# EAGLE design gpio4-st (EAGLE 7.2.0)
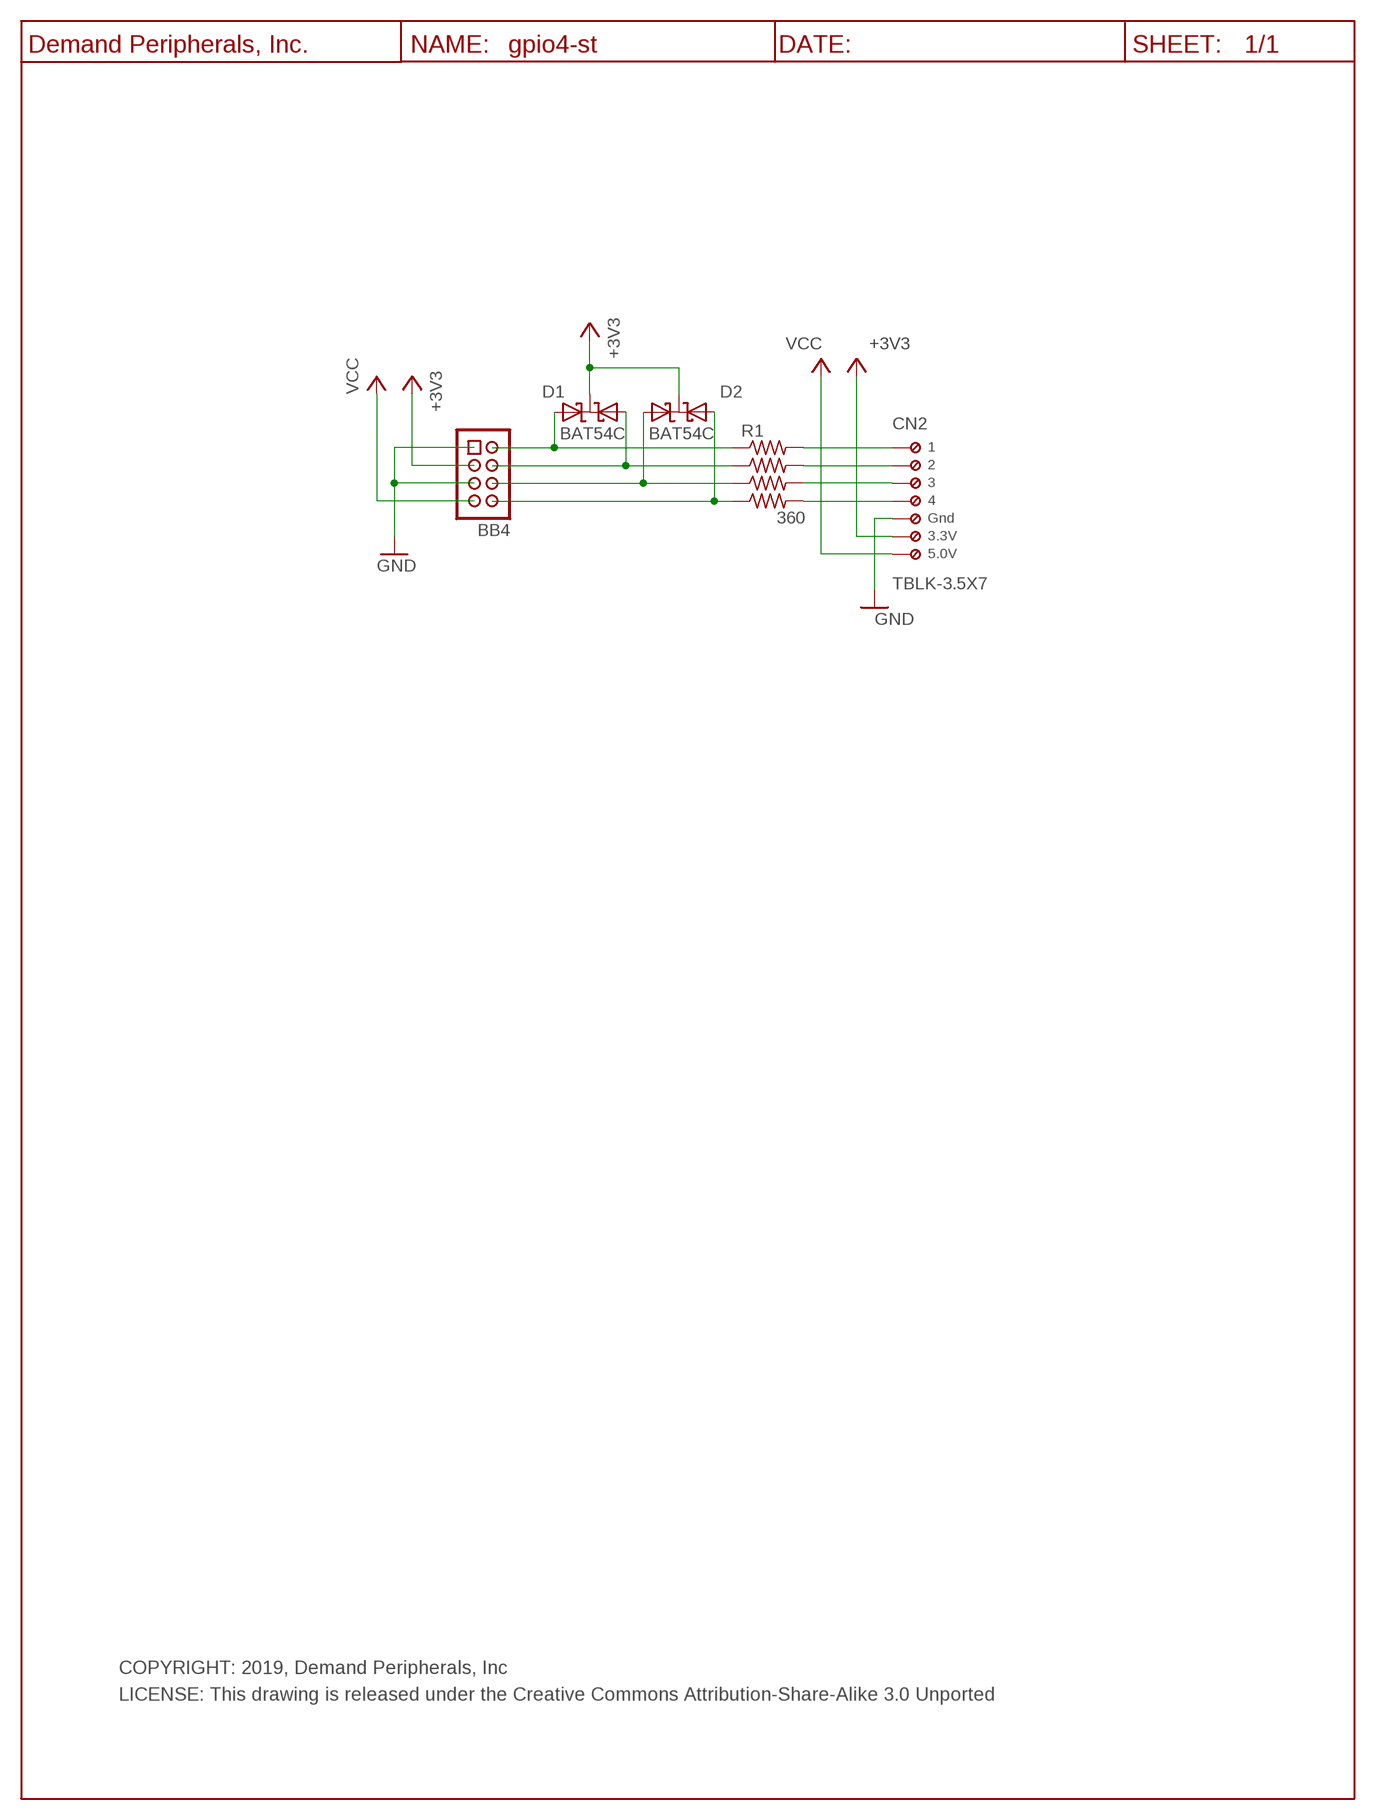
[diagram p0: schematic, sheet 1]

## Parts
BB4  BB_CON  HDR-4X2-SHR  [HDR-4X2]
CN2  TBLK-3.5X7  [TBLK-3.5X7]
D1  BAT54C  [SOT23]
D2  BAT54C  [SOT23]
R1  360  R360_R0603  [R0603]
R2  360  R360_R0603  [R0603]
R3  360  R360_R0603  [R0603]
R4  360  R360_R0603  [R0603]
U$1  DP_FRAME_P  [P_FRAME]

## Nets
+3V3: BB4.3 CN2.6(KL5) D1.3(CC) D2.3(CC)
GND: BB4.1 BB4.5 CN2.5(KL4)
N$1: CN2.1(KL) R1.2
N$2: CN2.2(KL1) R2.2
N$3: CN2.3(KL2) R3.2
N$4: CN2.4(KL3) R4.2
N$11: BB4.2 D1.1(A1) R1.1
N$12: BB4.4 D1.2(A) R2.1
N$14: BB4.6 D2.1(A1) R3.1
N$15: BB4.8 D2.2(A) R4.1
VCC: BB4.7 CN2.7(KL6)

## Notes on the sheet
- 1
- 2
- 3
- 4
- Gnd
- 3.3V
- 5.0V
- COPYRIGHT: 2019, Demand Peripherals, Inc
- LICENSE: This drawing is released under the Creative Commons Attribution-Share-Alike 3.0 Unported

## Library data of the parts
BB4 = dpi-conn:HDR-4X2-SHR: Shrouded 4x2 pin header; VENDOR: Digikey; VENDOR-PART-NUM: 609-3530-ND
CN2 = dpi-conn:TBLK-3.5X7: Screw terminal, 3.5mm, 7 position; VENDOR: Digikey; VENDOR-PART-NUM: ED2745-ND
D1 D2 = dpi-diopto:BAT54C: BAT54C Dual Common Cathode Schottky; VENDOR: Digikey; VENDOR-PART-NUM: DB3X313N0LCT-ND
R1-R4 = dpi-passive:R360_: 360 Ohm resistor, 1%, 0.1 watt; VENDOR: Digikey; VENDOR-PART-NUM: 311-360HRTR-ND
U$1 = dpi-sym:DP_FRAME_P: Portrait/Letter Document Frame

## Board
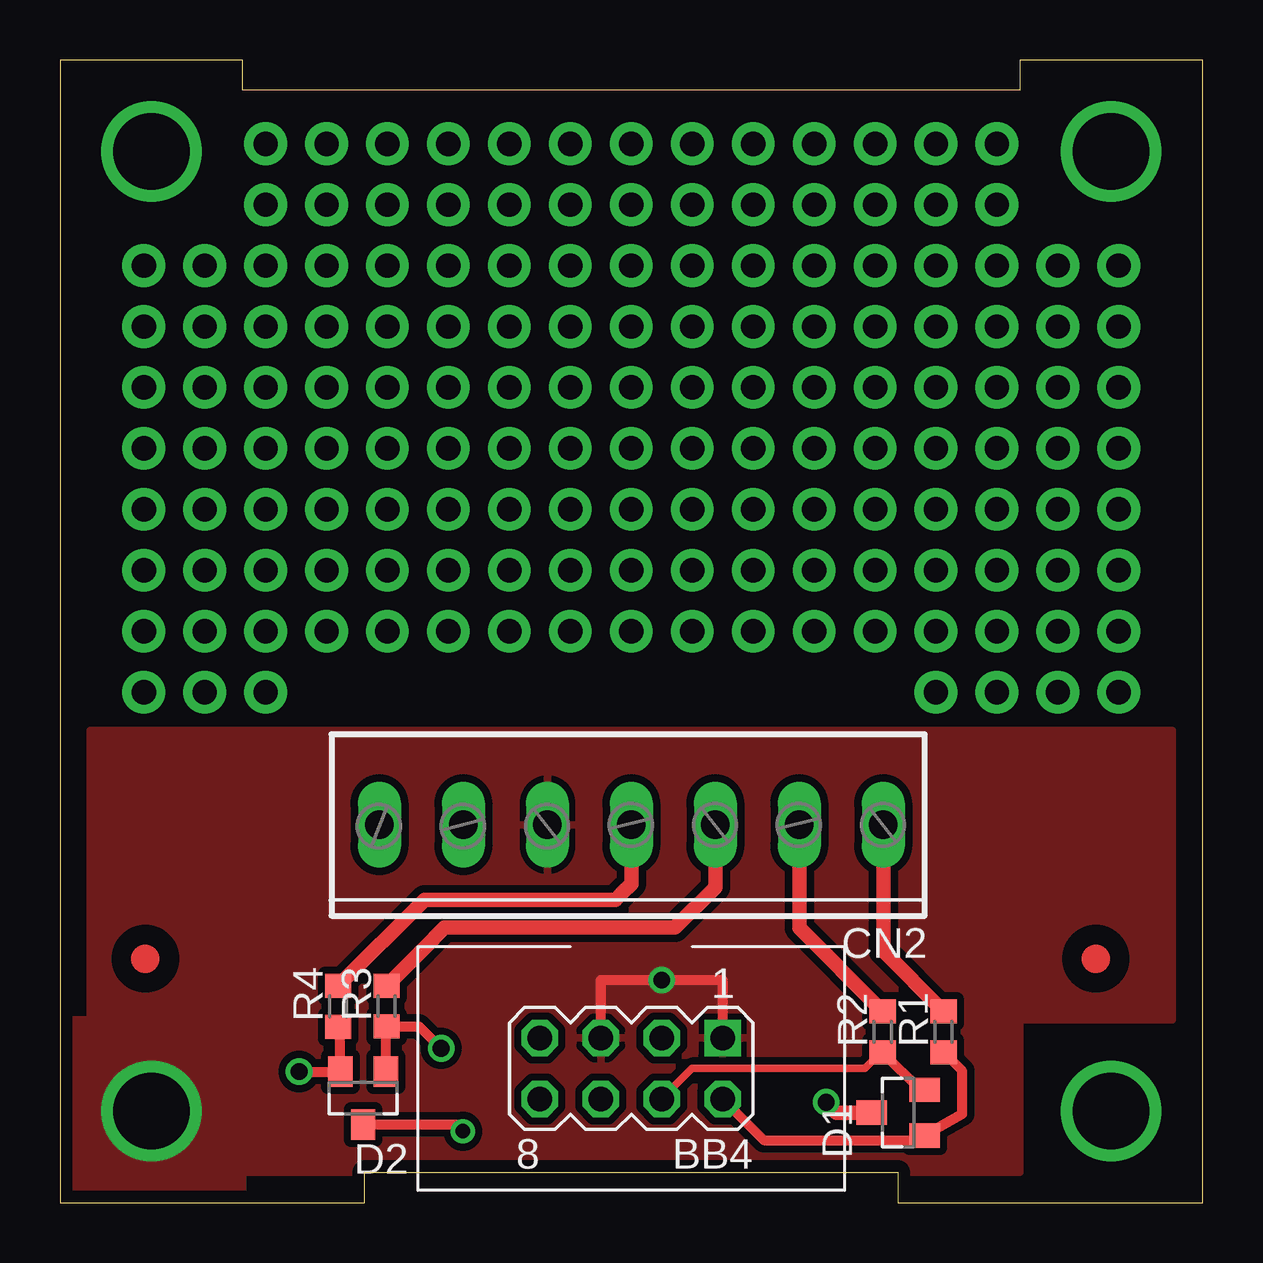
[diagram p1: board, top side]
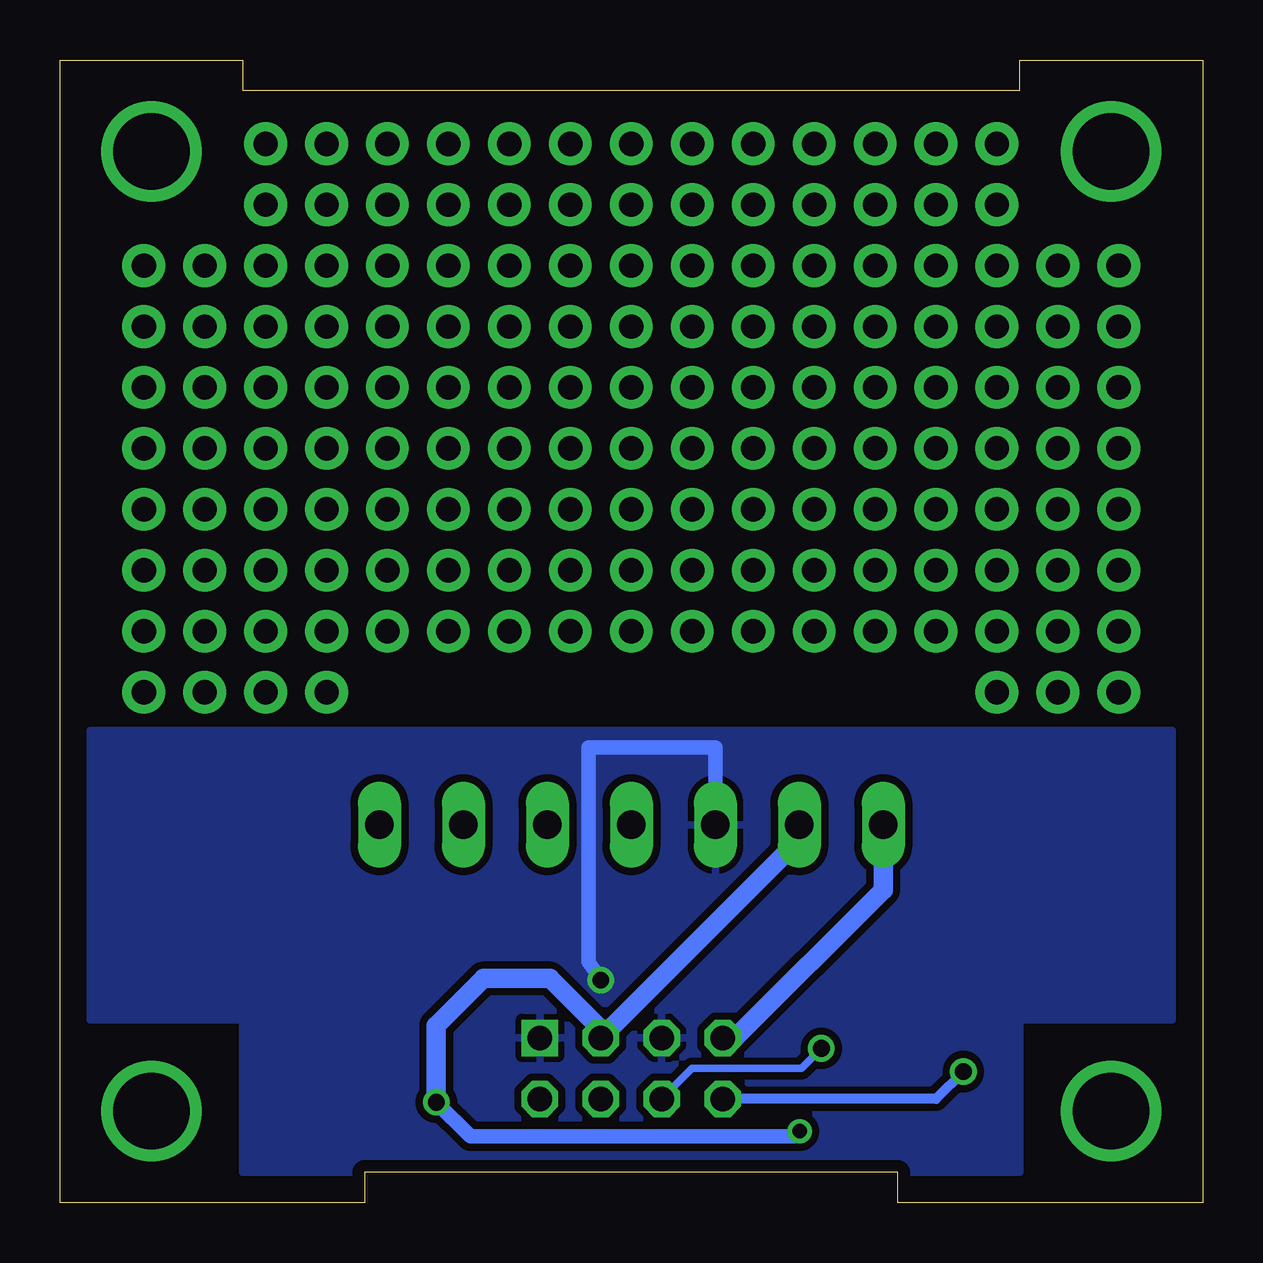
[diagram p2: board, bottom side, seen from below]

Size 47.62 x 47.62 mm. Coordinates in mm from the lower left corner, seen from the top.
Outline: 0,0 12.7,0 12.7,1.27 34.92,1.27 34.92,0 47.62,0 47.62,47.62 40.01,47.62 40.01,46.35 7.62,46.35 7.62,47.62 0,47.62 0,0
Copper layers (1*16): Top 0.035mm / dielectric 1.5mm / Bottom 0.035mm
Design rules "default *": minimum track width 10mil, minimum drill 24mil, track to track 12mil, track to pad 12mil, pad to pad 12mil, via to via 12mil, smd to smd 12mil, copper to edge 20mil, drill to drill 8mil, minimum pad ring 10mil, minimum via ring 8mil, stop-mask expansion 4mil, vias tented up to drill 0mil, thermal gap 10mil
tKeepout: area 15.1,1 to 32.5,9.7

### Footprints (pad centres in the part's own frame; a part is rotated, then mirrored left to right if it is on the bottom)
HDR-4X2 = drill 1.016 square: 1 -3.81,-1.27 | drill 1.016 octagon: 2 -3.81,1.27; 3 -1.27,-1.27; 4 -1.27,1.27; 5 1.27,-1.27; 6 1.27,1.27; 7 3.81,-1.27; 8 3.81,1.27
TBLK-3.5X7 = drill 1.2 long: 1 -10.5,0; 2 -7,0; 3 -3.5,0; 4 0,0; 5 3.5,0; 6 7,0; 7 10.5,0
SOT23 = smd 1.016 x 1.27: 1 -0.95,-1.1; 2 0.95,-1.1; 3 0,1.1
R0603 = smd 1 x 1.1: 1 -0.85,0; 2 0.85,0

### Placement (x,y rotation side)
BB4  23.81,5.59 180 top
CN2  23.81,15.75 180 top
D1  34.94,3.75 90 top
D2  12.64,4.36 180 top
R1  36.83,7.11 90 top
R2  34.29,7.11 90 top
R3  13.61,8.19 90 top
R4  11.6,8.18 90 top
U$1  -2.54,-2.54 0 top
U$2  [DPI-2]  3.94,16.51 90 bottom
U$3  [FIDUCIAL]  3.56,10.16 0 top
U$8  [FIDUCIAL]  43.18,10.16 0 top

### Tracks (layer width: path | path; a pad name or v marks a point on that pad's centre or on a via)
+3V3  (via drill 0.6, 0.7)
  Top 0.406: D2.3 16.5,3.26 v16.79,2.97
  Top 0.61: D1.3 32.37,3.75 v31.94,4.18
  Bottom 0.61: v16.79,2.97 17,2.76 30.52,2.76 v31.94,4.18
  Bottom 0.813: CN2.6 16.81,14.62 17.32,14.62 BB4.3 25.08,7.21 27.2,9.34 29.97,9.34 31.94,7.37 v31.94,4.18
GND  (via drill 0.7, 3.17 pad 3.17)
  Top 0.406: BB4.5 22.54,9.27 v25.08,9.27 27.62,9.27 BB4.1
  Bottom 0.61: v25.08,9.27 25.6,10.03 25.6,18.97 20.31,18.97 CN2.5
  other vias: 3.81,3.81
  pour Bottom: 7.62,1.27 7.62,7.62 1.27,7.62 1.27,19.68 46.35,19.68 46.35,7.62 40.01,7.62 40.01,1.27
  pour Top: 0.51,0.51 0.51,7.62 1.27,7.62 1.27,19.68 46.35,19.68 46.35,7.62 40.01,7.62 40.01,1.27 7.62,1.27 7.62,0.51
MOUNT  (via drill 3.17 pad 3.17)
  other vias: 43.81,43.81
N$1
  Top 0.61: R1.2 34.31,10.48 CN2.1
N$2
  Top 0.61: R2.2 30.81,11.44 CN2.2
N$3
  Top 0.61: R3.2 15.15,10.58 16.04,11.47 25.64,11.47 27.31,13.14 27.31,13.89 CN2.3
N$4
  Top 0.61: R4.2 15.19,12.62 19.43,12.62 23.15,12.62 23.41,12.88 23.81,13.28 CN2.4
N$11
  Top 0.406: R1.1 37.6,5.49 37.6,3.7 D1.1 35.84,2.6 29.34,2.6 BB4.2
N$12
  Top 0.305: 34.23,6.26 33.55,5.59 26.94,5.59 26.35,5.59 BB4.4
  Top 0.406: 34.23,6.26 R2.1 35.85,4.7 D1.2
N$13  (via drill 3.17 pad 3.17)
  other vias: 3.81,43.81
N$14  (via drill 0.7)
  Top 0.406: v15.89,6.43 14.97,7.34 R3.1 13.59,7.31 D2.1
  Bottom 0.305: BB4.6 21.27,5.59 18.54,5.59 16.73,5.59 v15.89,6.43
N$15  (via drill 0.7)
  Top 0.406: R4.1 11.69,7.24 D2.2 v9.97,5.46
  Bottom 0.406: v9.97,5.46 11.11,4.32 BB4.8
N$22  (via drill 3.17 pad 3.17)
  other vias: 43.81,3.81
VCC
  Bottom 0.813: CN2.7 13.31,13.04 19.49,6.86 BB4.7
WW1  (via drill 1.02 pad 1.78)
  other vias: 36.51,23.81
WW2  (via drill 1.02 pad 1.78)
  other vias: 36.51,28.89
WW3  (via drill 1.02 pad 1.78)
  other vias: 3.49,26.35
WW4  (via drill 1.02 pad 1.78)
  other vias: 3.49,23.81
WW5  (via drill 1.02 pad 1.78)
  other vias: 3.49,28.89
WW6  (via drill 1.02 pad 1.78)
  other vias: 3.49,31.43
WW7  (via drill 1.02 pad 1.78)
  other vias: 3.49,33.97
WW8  (via drill 1.02 pad 1.78)
  other vias: 3.49,36.51
WW9  (via drill 1.02 pad 1.78)
  other vias: 3.49,39.05
WW10  (via drill 1.02 pad 1.78)
  other vias: 39.05,23.81
WW11  (via drill 1.02 pad 1.78)
  other vias: 39.05,28.89
WW12  (via drill 1.02 pad 1.78)
  other vias: 3.49,21.27
WW13  (via drill 1.02 pad 1.78)
  other vias: 6.03,26.35
WW14  (via drill 1.02 pad 1.78)
  other vias: 8.57,26.35
WW15  (via drill 1.02 pad 1.78)
  other vias: 11.11,26.35
WW16  (via drill 1.02 pad 1.78)
  other vias: 6.03,23.81
WW17  (via drill 1.02 pad 1.78)
  other vias: 6.03,28.89
WW18  (via drill 1.02 pad 1.78)
  other vias: 6.03,31.43
WW19  (via drill 1.02 pad 1.78)
  other vias: 6.03,33.97
WW20  (via drill 1.02 pad 1.78)
  other vias: 6.03,36.51
WW21  (via drill 1.02 pad 1.78)
  other vias: 6.03,39.05
WW22  (via drill 1.02 pad 1.78)
  other vias: 41.59,23.81
WW23  (via drill 1.02 pad 1.78)
  other vias: 41.59,28.89
WW24  (via drill 1.02 pad 1.78)
  other vias: 13.65,26.35
WW25  (via drill 1.02 pad 1.78)
  other vias: 16.19,26.35
WW26  (via drill 1.02 pad 1.78)
  other vias: 18.73,26.35
WW27  (via drill 1.02 pad 1.78)
  other vias: 21.27,26.35
WW28  (via drill 1.02 pad 1.78)
  other vias: 8.57,23.81
WW29  (via drill 1.02 pad 1.78)
  other vias: 8.57,28.89
WW30  (via drill 1.02 pad 1.78)
  other vias: 8.57,31.43
WW31  (via drill 1.02 pad 1.78)
  other vias: 8.57,33.97
WW32  (via drill 1.02 pad 1.78)
  other vias: 8.57,36.51
WW33  (via drill 1.02 pad 1.78)
  other vias: 8.57,39.05
WW34  (via drill 1.02 pad 1.78)
  other vias: 8.57,41.59
WW35  (via drill 1.02 pad 1.78)
  other vias: 8.57,44.13
WW36  (via drill 1.02 pad 1.78)
  other vias: 44.13,23.81
WW37  (via drill 1.02 pad 1.78)
  other vias: 23.81,26.35
WW38  (via drill 1.02 pad 1.78)
  other vias: 26.35,26.35
WW39  (via drill 1.02 pad 1.78)
  other vias: 28.89,26.35
WW40  (via drill 1.02 pad 1.78)
  other vias: 11.11,23.81
WW41  (via drill 1.02 pad 1.78)
  other vias: 11.11,28.89
WW42  (via drill 1.02 pad 1.78)
  other vias: 11.11,31.43
WW43  (via drill 1.02 pad 1.78)
  other vias: 11.11,33.97
WW44  (via drill 1.02 pad 1.78)
  other vias: 11.11,36.51
WW45  (via drill 1.02 pad 1.78)
  other vias: 11.11,39.05
WW46  (via drill 1.02 pad 1.78)
  other vias: 11.11,41.59
WW47  (via drill 1.02 pad 1.78)
  other vias: 11.11,44.13
WW48  (via drill 1.02 pad 1.78)
  other vias: 44.13,28.89
WW49  (via drill 1.02 pad 1.78)
  other vias: 31.43,26.35
WW51  (via drill 1.02 pad 1.78)
  other vias: 33.97,26.35
WW52  (via drill 1.02 pad 1.78)
  other vias: 13.65,23.81
WW53  (via drill 1.02 pad 1.78)
  other vias: 13.65,28.89
WW54  (via drill 1.02 pad 1.78)
  other vias: 13.65,31.43
WW55  (via drill 1.02 pad 1.78)
  other vias: 13.65,33.97
WW56  (via drill 1.02 pad 1.78)
  other vias: 13.65,36.51
WW57  (via drill 1.02 pad 1.78)
  other vias: 13.65,39.05
WW58  (via drill 1.02 pad 1.78)
  other vias: 13.65,41.59
WW59  (via drill 1.02 pad 1.78)
  other vias: 13.65,44.13
WW60  (via drill 1.02 pad 1.78)
  other vias: 36.51,26.35
WW61  (via drill 1.02 pad 1.78)
  other vias: 6.03,21.27
WW62  (via drill 1.02 pad 1.78)
  other vias: 39.05,26.35
WW63  (via drill 1.02 pad 1.78)
  other vias: 41.59,26.35
WW64  (via drill 1.02 pad 1.78)
  other vias: 16.19,23.81
WW65  (via drill 1.02 pad 1.78)
  other vias: 16.19,28.89
WW66  (via drill 1.02 pad 1.78)
  other vias: 16.19,31.43
WW67  (via drill 1.02 pad 1.78)
  other vias: 16.19,33.97
WW68  (via drill 1.02 pad 1.78)
  other vias: 16.19,36.51
WW69  (via drill 1.02 pad 1.78)
  other vias: 16.19,39.05
WW70  (via drill 1.02 pad 1.78)
  other vias: 16.19,41.59
WW71  (via drill 1.02 pad 1.78)
  other vias: 16.19,44.13
WW73  (via drill 1.02 pad 1.78)
  other vias: 44.13,26.35
WW76  (via drill 1.02 pad 1.78)
  other vias: 18.73,23.81
WW77  (via drill 1.02 pad 1.78)
  other vias: 18.73,28.89
WW78  (via drill 1.02 pad 1.78)
  other vias: 18.73,31.43
WW79  (via drill 1.02 pad 1.78)
  other vias: 18.73,33.97
WW80  (via drill 1.02 pad 1.78)
  other vias: 18.73,36.51
WW81  (via drill 1.02 pad 1.78)
  other vias: 18.73,39.05
WW82  (via drill 1.02 pad 1.78)
  other vias: 18.73,41.59
WW83  (via drill 1.02 pad 1.78)
  other vias: 18.73,44.13
WW88  (via drill 1.02 pad 1.78)
  other vias: 21.27,23.81
WW89  (via drill 1.02 pad 1.78)
  other vias: 21.27,28.89
WW90  (via drill 1.02 pad 1.78)
  other vias: 21.27,31.43
WW91  (via drill 1.02 pad 1.78)
  other vias: 21.27,33.97
WW92  (via drill 1.02 pad 1.78)
  other vias: 21.27,36.51
WW93  (via drill 1.02 pad 1.78)
  other vias: 21.27,39.05
WW94  (via drill 1.02 pad 1.78)
  other vias: 21.27,41.59
WW95  (via drill 1.02 pad 1.78)
  other vias: 21.27,44.13
WW100  (via drill 1.02 pad 1.78)
  other vias: 23.81,23.81
WW101  (via drill 1.02 pad 1.78)
  other vias: 23.81,28.89
WW102  (via drill 1.02 pad 1.78)
  other vias: 23.81,31.43
WW103  (via drill 1.02 pad 1.78)
  other vias: 23.81,33.97
WW104  (via drill 1.02 pad 1.78)
  other vias: 23.81,36.51
WW105  (via drill 1.02 pad 1.78)
  other vias: 23.81,39.05
WW106  (via drill 1.02 pad 1.78)
  other vias: 23.81,41.59
WW107  (via drill 1.02 pad 1.78)
  other vias: 23.81,44.13
WW111  (via drill 1.02 pad 1.78)
  other vias: 8.57,21.27
WW112  (via drill 1.02 pad 1.78)
  other vias: 26.35,23.81
WW113  (via drill 1.02 pad 1.78)
  other vias: 26.35,28.89
WW114  (via drill 1.02 pad 1.78)
  other vias: 26.35,31.43
WW115  (via drill 1.02 pad 1.78)
  other vias: 26.35,33.97
WW116  (via drill 1.02 pad 1.78)
  other vias: 26.35,36.51
WW117  (via drill 1.02 pad 1.78)
  other vias: 26.35,39.05
WW118  (via drill 1.02 pad 1.78)
  other vias: 26.35,41.59
WW119  (via drill 1.02 pad 1.78)
  other vias: 26.35,44.13
WW124  (via drill 1.02 pad 1.78)
  other vias: 28.89,23.81
WW125  (via drill 1.02 pad 1.78)
  other vias: 28.89,28.89
WW126  (via drill 1.02 pad 1.78)
  other vias: 28.89,31.43
WW127  (via drill 1.02 pad 1.78)
  other vias: 28.89,33.97
WW128  (via drill 1.02 pad 1.78)
  other vias: 28.89,36.51
WW129  (via drill 1.02 pad 1.78)
  other vias: 28.89,39.05
WW130  (via drill 1.02 pad 1.78)
  other vias: 28.89,41.59
WW131  (via drill 1.02 pad 1.78)
  other vias: 28.89,44.13
WW136  (via drill 1.02 pad 1.78)
  other vias: 31.43,23.81
WW137  (via drill 1.02 pad 1.78)
  other vias: 31.43,28.89
WW138  (via drill 1.02 pad 1.78)
  other vias: 31.43,31.43
WW139  (via drill 1.02 pad 1.78)
  other vias: 31.43,33.97
WW140  (via drill 1.02 pad 1.78)
  other vias: 31.43,36.51
WW141  (via drill 1.02 pad 1.78)
  other vias: 31.43,39.05
WW142  (via drill 1.02 pad 1.78)
  other vias: 31.43,41.59
WW143  (via drill 1.02 pad 1.78)
  other vias: 31.43,44.13
WW148  (via drill 1.02 pad 1.78)
  other vias: 33.97,23.81
WW149  (via drill 1.02 pad 1.78)
  other vias: 33.97,28.89
WW150  (via drill 1.02 pad 1.78)
  other vias: 33.97,31.43
WW151  (via drill 1.02 pad 1.78)
  other vias: 33.97,33.97
WW152  (via drill 1.02 pad 1.78)
  other vias: 33.97,36.51
WW153  (via drill 1.02 pad 1.78)
  other vias: 33.97,39.05
WW154  (via drill 1.02 pad 1.78)
  other vias: 33.97,41.59
WW155  (via drill 1.02 pad 1.78)
  other vias: 33.97,44.13
WW162  (via drill 1.02 pad 1.78)
  other vias: 36.51,31.43
WW163  (via drill 1.02 pad 1.78)
  other vias: 36.51,33.97
WW164  (via drill 1.02 pad 1.78)
  other vias: 36.51,36.51
WW165  (via drill 1.02 pad 1.78)
  other vias: 36.51,39.05
WW166  (via drill 1.02 pad 1.78)
  other vias: 36.51,41.59
WW167  (via drill 1.02 pad 1.78)
  other vias: 36.51,44.13
WW168  (via drill 1.02 pad 1.78)
  other vias: 36.51,21.27
WW170  (via drill 1.02 pad 1.78)
  other vias: 39.05,21.27
WW172  (via drill 1.02 pad 1.78)
  other vias: 41.59,21.27
WW174  (via drill 1.02 pad 1.78)
  other vias: 39.05,31.43
WW175  (via drill 1.02 pad 1.78)
  other vias: 39.05,33.97
WW176  (via drill 1.02 pad 1.78)
  other vias: 39.05,36.51
WW177  (via drill 1.02 pad 1.78)
  other vias: 39.05,39.05
WW178  (via drill 1.02 pad 1.78)
  other vias: 39.05,41.59
WW179  (via drill 1.02 pad 1.78)
  other vias: 39.05,44.13
WW180  (via drill 1.02 pad 1.78)
  other vias: 44.13,21.27
WW186  (via drill 1.02 pad 1.78)
  other vias: 41.59,31.43
WW187  (via drill 1.02 pad 1.78)
  other vias: 41.59,33.97
WW188  (via drill 1.02 pad 1.78)
  other vias: 41.59,36.51
WW189  (via drill 1.02 pad 1.78)
  other vias: 41.59,39.05
WW198  (via drill 1.02 pad 1.78)
  other vias: 44.13,31.43
WW199  (via drill 1.02 pad 1.78)
  other vias: 44.13,33.97
WW200  (via drill 1.02 pad 1.78)
  other vias: 44.13,36.51
WW201  (via drill 1.02 pad 1.78)
  other vias: 44.13,39.05

### Text on the board
tTest: 1.875 Inches | 1.575 Inches | GPIO4-ST, Rev 19A | 50 | 33 | Gnd | 4 | 3 | 2 | 1 | 1.575 Inches | 1.875 Inches | BB4 | R4 | R3 | R2 | R1 | (C) 2019, Demand Peripherals, Inc. | D2 | D1